# Altium project EDA-04211-V4-0_project.PrjPCB (part 3 of 3)

## Sheet Power.SchDoc: CPCI-Serial Backplane
size 420 x 297 mm; Date: 06/04/2023; CheckedBy: EG; GD; GK; MS; DrawnBy: M. Gąska; Address1: European Organization for Nuclear Research; Address2: CH-1211 Geneve 23 - Switzerland; DocumentNumber: 2; Revision: 2; SheetNumber: 2; SheetTotal: 5; Projet: DI/OT Crate; DivGrp: BE-CO; Title2: Power; Designer: G.Daniluk; ModifiedBy: M.Fafara; EDA_Number: EDA-04211-V4_0; CreateDate: 06/04/2023; CheckedDate: 06/04/2023
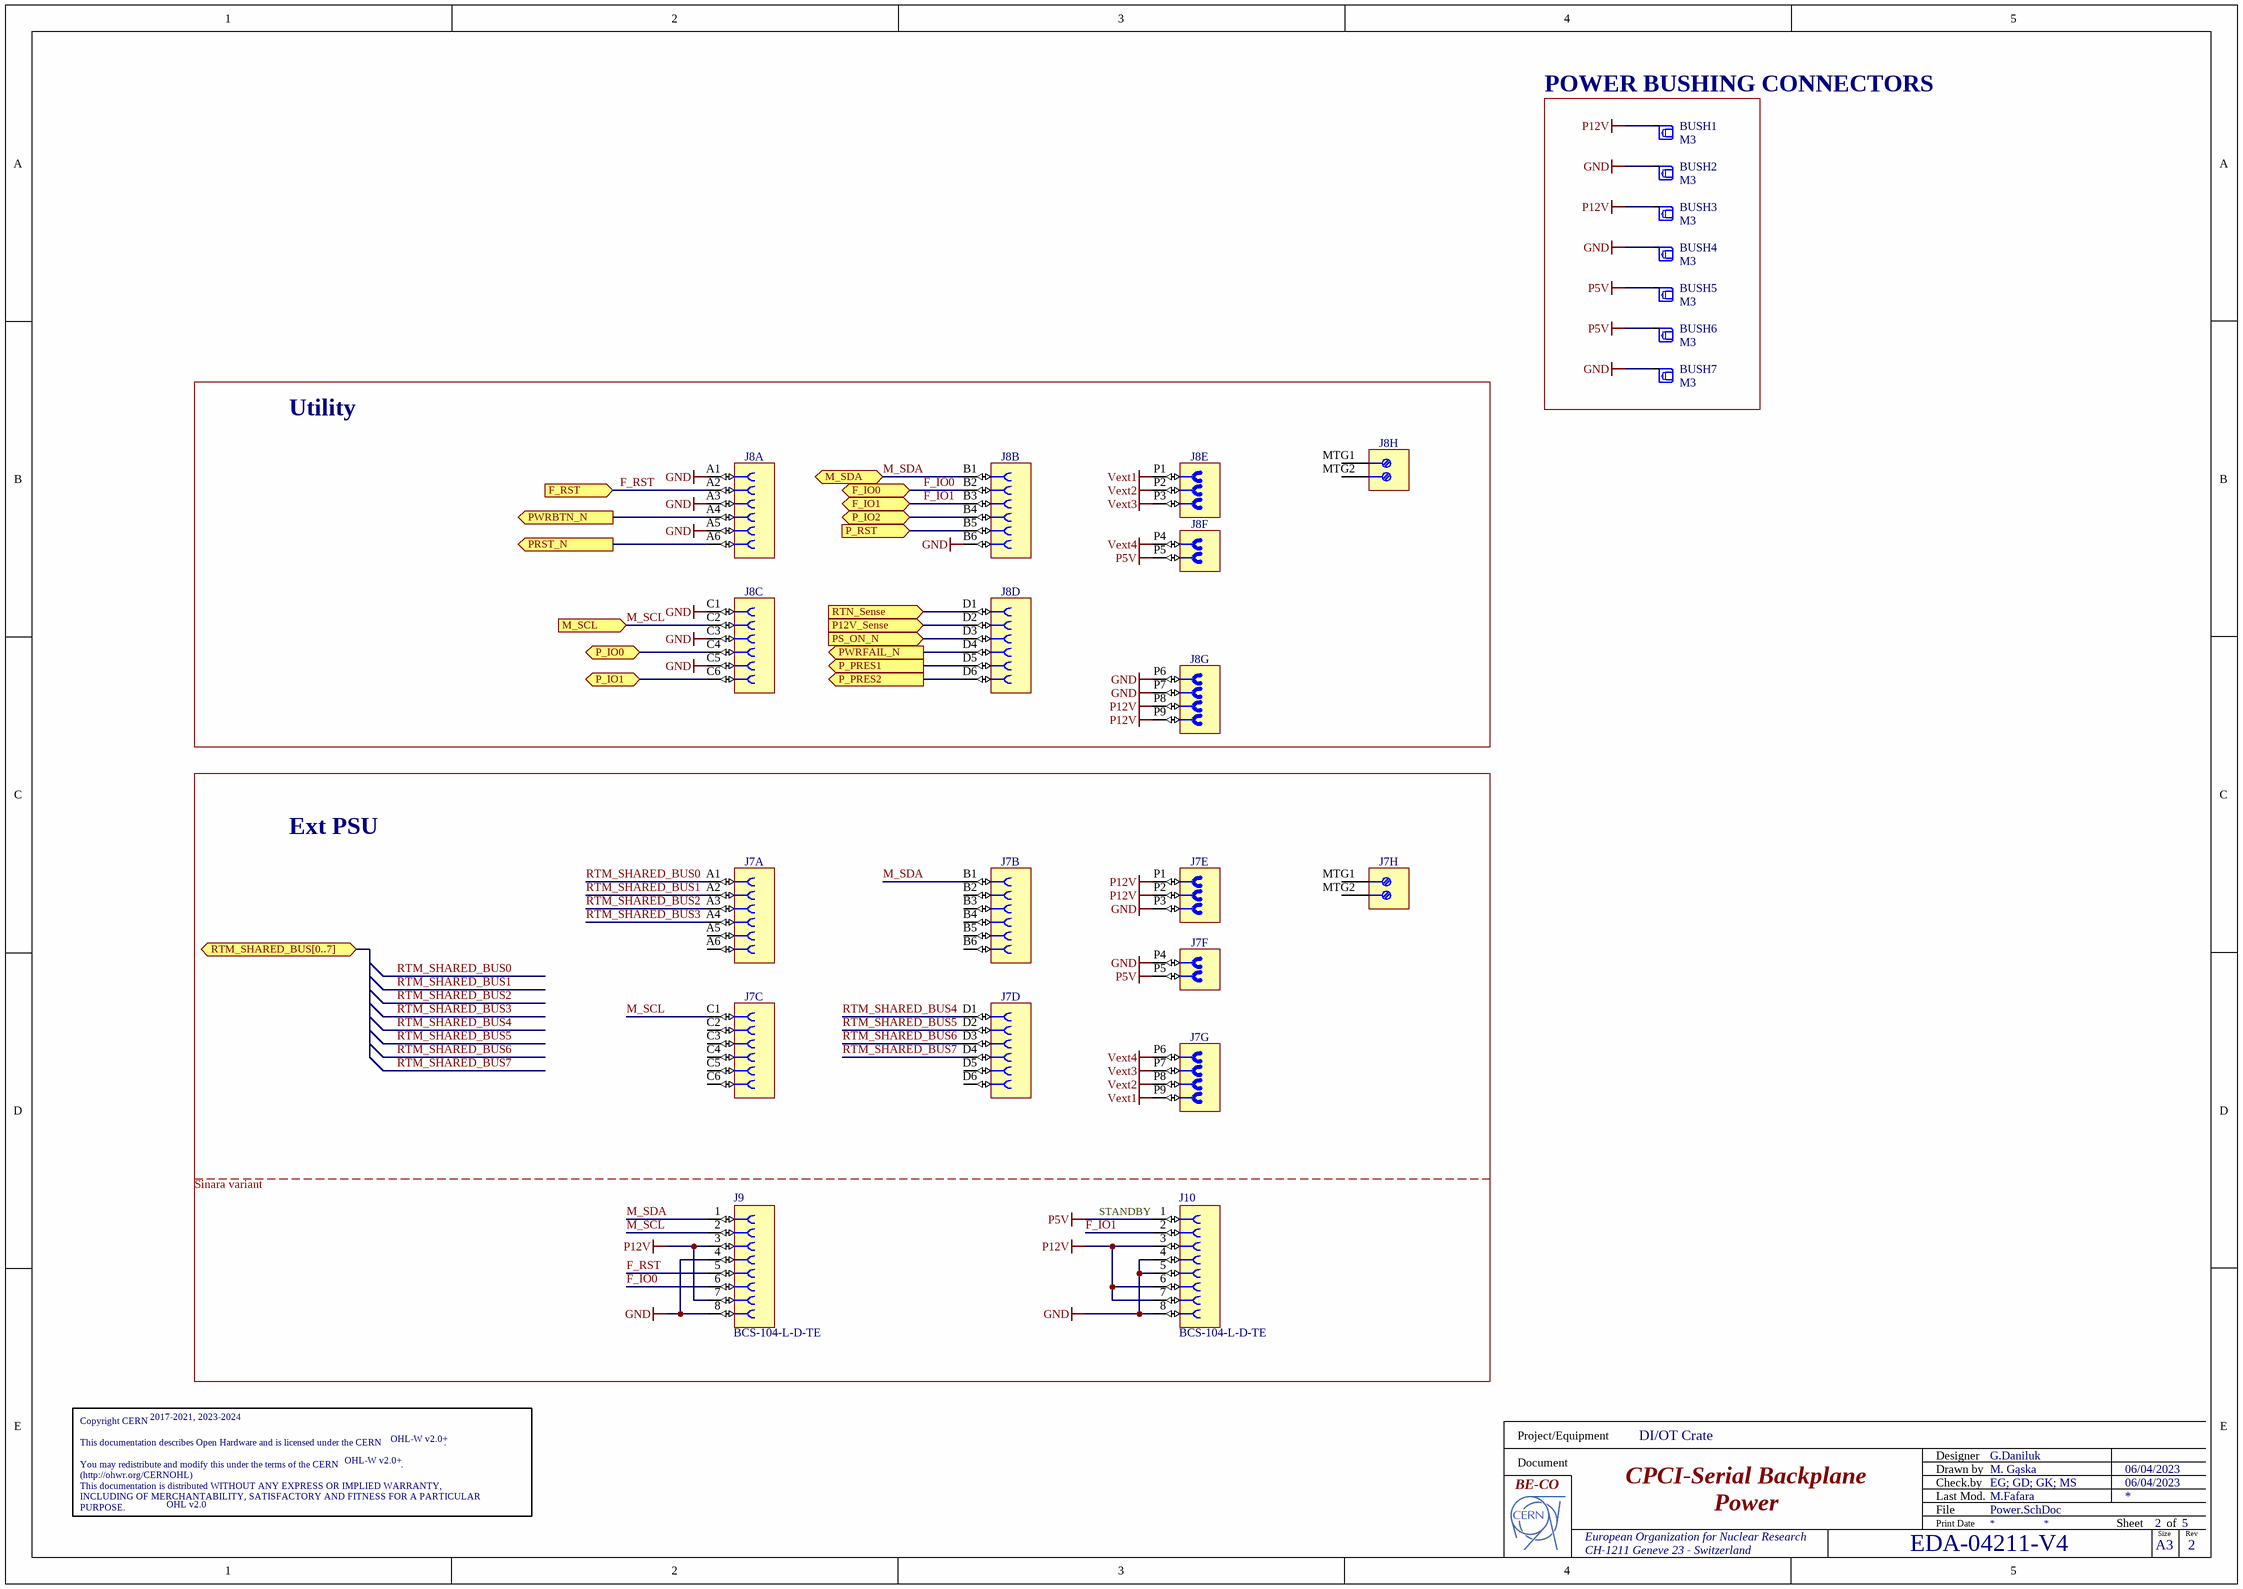
[diagram p2: Power.SchDoc]

### Parts
(Parts that share a designator on the sheet are numbered #1, #2 ... from top to bottom, then left to right.)
BUSH1  M3  [WURTH_7461057]
BUSH2  M3  [WURTH_7461057]
BUSH3  M3  [WURTH_7461057]
BUSH4  M3  [WURTH_7461057]
BUSH5  M3  [WURTH_7461057]
BUSH6  M3  [WURTH_7461057]
BUSH7  M3  [WURTH_7461057]
CERN_OHL#2  CERN_OHL  [CERN_OHL]  (value not drawn)  (graphical)
J7  PwrBlade  [AMPHENOL_51940-650]  (value not drawn)  (parts A,B,C,D,E,F,G,H of 8)
J8  PwrBlade  [AMPHENOL_51940-650]  (value not drawn)  (parts A,B,C,D,E,F,G,H of 8)
J9  BCS-104-L-D-TE  [SAMTEC_BCS-104-L-D-TE]
J10  BCS-104-L-D-TE  [SAMTEC_BCS-104-L-D-TE]

### Blocks framed on the sheet
POWER BUSHING CONNECTORS: BUSH1-BUSH7
Utility: J8
Ext PSU: J7 J9 J10

### Ports
F_IO0 (bidir), F_IO1 (bidir), F_RST (in), M_SCL (in), M_SDA (bidir), P12V_Sense (in), P_IO0 (bidir), P_IO1 (bidir), P_IO2 (bidir), P_PRES1 (out), P_PRES2 (out), P_RST (in), PRST_N (out), PS_ON_N (in), PWRBTN_N (out), PWRFAIL_N (out), RTM_SHARED_BUS[0..7] (bidir), RTN_Sense (in)

### Nets
GND: BUSH2.1 BUSH4.1 BUSH7.1 J7.P3 J7.P4 J8.A1 J8.A3 J8.A5 J8.B6 J8.C1 J8.C3 J8.C5 J8.P6 J8.P7 J9.4 J9.8 J10.4 J10.5 J10.8
P5V: BUSH5.1 BUSH6.1 J7.P5 J8.P5 J10.1
P12V: BUSH1.1 BUSH3.1 J7.P1 J7.P2 J8.P8 J8.P9 J9.3 J9.7 J10.3 J10.6 J10.7
Vext1: J7.P9 J8.P1
Vext2: J7.P8 J8.P2
Vext3: J7.P7 J8.P3
Vext4: J7.P6 J8.P4
F_IO0: J8.B2 J9.6 ; port F_IO0
F_IO1: J8.B3 J10.2 ; port F_IO1
F_RST: J8.A2 J9.5 ; port F_RST
M_SCL: J7.C1 J8.C2 J9.2 ; port M_SCL
M_SDA: J7.B1 J8.B1 J9.1 ; port M_SDA
P12V_Sense: J8.D2 ; port P12V_Sense
P_IO0: J8.C4 ; port P_IO0
P_IO1: J8.C6 ; port P_IO1
P_IO2: J8.B4 ; port P_IO2
P_PRES1: J8.D5 ; port P_PRES1
P_PRES2: J8.D6 ; port P_PRES2
P_RST: J8.B5 ; port P_RST
PRST_N: J8.A6 ; port PRST_N
PS_ON_N: J8.D3 ; port PS_ON_N
PWRBTN_N: J8.A4 ; port PWRBTN_N
PWRFAIL_N: J8.D4 ; port PWRFAIL_N
RTM_SHARED_BUS0: J7.A1
RTM_SHARED_BUS1: J7.A2
RTM_SHARED_BUS2: J7.A3
RTM_SHARED_BUS3: J7.A4
RTM_SHARED_BUS4: J7.D1
RTM_SHARED_BUS5: J7.D2
RTM_SHARED_BUS6: J7.D3
RTM_SHARED_BUS7: J7.D4
RTN_Sense: J8.D1 ; port RTN_Sense

Not connected (* = marked no-connect by the designer): J7 A5 A6 B2 B3 B4 B5 B6 C2 C3 C4 C5 C6 D5 D6 MTG1 MTG2; J8 MTG1 MTG2

### Notes on the sheet
- Sinara variant
- (near J10) STANDBY
- Project/Equipment
- Document
- Designer
- Drawn by
- Check.by
- File
- Last Mod.
- Print Date
- Sheet
- Size
- A3
- of
- Rev
- (in symbol CERN_OHL) Copyright CERN / This documentation describes Open Hardware and is licensed under the CERN                         . / You may redistribute and modify this under the terms of the CERN                         . / (http://ohwr.org/CERNOHL) / This documentation is distributed WITHOUT ANY EXPRESS OR IMPLIED WARRANTY, / INCLUDING OF MERCHANTABILITY, SATISFACTORY AND FITNESS FOR A PARTICULAR PURPOSE. / Please see the CERN                   for applicable conditions.

### Library data of the parts
BUSH1-BUSH7 = WURTH_7461057: Bush; Part Description: REDCUBE Bush with Threaded Hole M3 and Two Rows Press-Fit Pin-Plate, WP-BUTR Series; Manufacturer: WURTH; Part Number: WURTH_7461057; Component Kind: Standard; Component Type: Standard; Pin Count: 6; PackageDescription: 7x7x6mm REDCUBE Press-Fit with Internsl Threaded Hole M3,Two Rows Pin-Plate WP-BUTR; Mounted: Yes; Socket: No; SMD: No; PressFit: Yes; Sense: No; Status: None; Value: M3; Manufacturer Part Number: 7461057; ComponentHeight: 6mm; HelpURL: \\cern.ch\dfs\Applications\Altium\Datasheets\WURTH_7461057.pdf; Author: CERN DEM JLC; CreateDate: 13.08.2018; LatestRevisionDate: 13.08.2018
CERN_OHL#2 = CERN_OHL: as CERN_OHL#1 on sheet EDA-04211-V4; OHL_Date: 2017-2021, 2023-2024; Part Number: CERN_OHL; Component Type: Standard (No BOM); Pin Count: 0; Socket: No; SMD: No; Sense: No; Status: None; ComponentHeight: 0mm; HelpURL: Undefined; Author: CERN DEM HF; CreateDate: 03/12/2021; LatestRevisionDate: 03/12/2021; PackageDescription: Texte Copyright Cern
J7 J8 = AMPHENOL_51940-650: Thru-Hole, Lead 3.43mm, PowerBlade Vertical Power Connector 3ACP 2P 24S 4DCP Contacts; Part Description: Vertical PowerBlade Power Connector 3ACP + 2P + 24S + 4DCP PressFit Contacts; Part Number: AMPHENOL_51940-650; Component Kind: Standard; Component Type: Standard; Pin Count: 28; Family: PwrBlade; Mounted: Yes; Socket: No; SMD: No; PressFit: Yes; Sense: No; Status: None; Manufacturer: AMPHENOL; Manufacturer Part Number: 51940-650; ComponentHeight: 12.7mm; HelpURL: \\cern.ch\dfs\Applications\Altium\Datasheets\AMPHENOL_51940-650.pdf; Author: CERN DEM HF
  J7: CreateDate: 13.12.2022; LatestRevisionDate: 13.12.2022
  J8: CreateDate: 13/12/2022; LatestRevisionDate: 13/12/2022
J9 J10 = CMP-002-04655-3: Board Connector, 8 Contact(s), 2 Row(s), Female, Straight, 0.1 inch Pitch, Solder Terminal, Black Insulator, Plug; Max Operating Temperature: 125°C; Min Operating Temperature: -65°C; Mounting Technology: Board; RoHS Compliant: Yes; Connector Type: BOARD CONNECTOR

## Sheet Slot_1b.SchDoc: CPCI-Serial Backplane
size 420 x 297 mm; Date: 05/04/2023; CheckedBy: EG; GD; GK; MS; DrawnBy: M. Gąska; Address1: European Organization for Nuclear Research; Address2: CH-1211 Geneve 23 - Switzerland; DocumentNumber: 3; Revision: 2; SheetNumber: 3; SheetTotal: 5; Projet: DI/OT Crate; DivGrp: BE-CO; Title2: Slot 1b; Designer: G.Daniluk; ModifiedBy: J.Kuhn; EDA_Number: EDA-04211-V4_0; CreateDate: 05/04/2023; CheckedDate: 05/04/2023
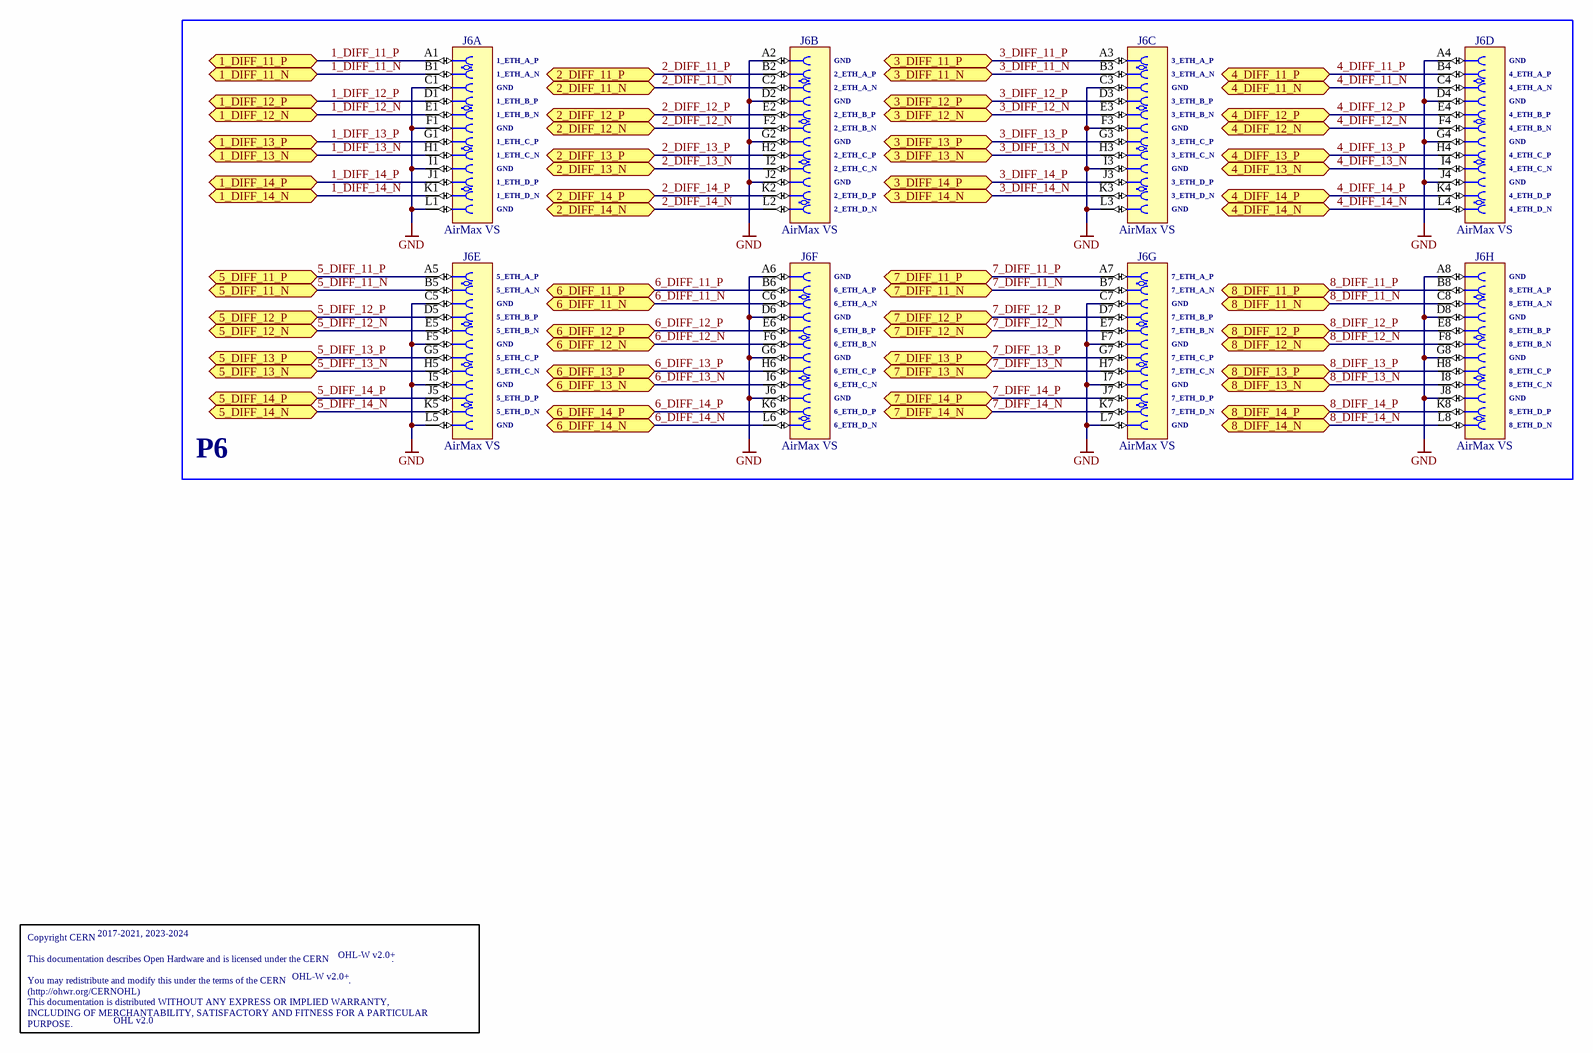
[diagram p3: Slot_1b.SchDoc]

### Parts
(Parts that share a designator on the sheet are numbered #1, #2 ... from top to bottom, then left to right.)
CERN_OHL#3  CERN_OHL  [CERN_OHL]  (value not drawn)  (graphical)
J6  AirMax VS  [AMPHENOL_10052842-101LF]  (parts A,B,C,D,E,F,G,H of 8)

### Blocks framed on the sheet
P6: J6

### Ports
1_DIFF_11_N (bidir), 1_DIFF_11_P (bidir), 1_DIFF_12_N (bidir), 1_DIFF_12_P (bidir), 1_DIFF_13_N (bidir), 1_DIFF_13_P (bidir), 1_DIFF_14_N (bidir), 1_DIFF_14_P (bidir), 2_DIFF_11_N (bidir), 2_DIFF_11_P (bidir), 2_DIFF_12_N (bidir), 2_DIFF_12_P (bidir), 2_DIFF_13_N (bidir), 2_DIFF_13_P (bidir), 2_DIFF_14_N (bidir), 2_DIFF_14_P (bidir), 3_DIFF_11_N (bidir), 3_DIFF_11_P (bidir), 3_DIFF_12_N (bidir), 3_DIFF_12_P (bidir), 3_DIFF_13_N (bidir), 3_DIFF_13_P (bidir), 3_DIFF_14_N (bidir), 3_DIFF_14_P (bidir), 4_DIFF_11_N (bidir), 4_DIFF_11_P (bidir), 4_DIFF_12_N (bidir), 4_DIFF_12_P (bidir), 4_DIFF_13_N (bidir), 4_DIFF_13_P (bidir), 4_DIFF_14_N (bidir), 4_DIFF_14_P (bidir), 5_DIFF_11_N (bidir), 5_DIFF_11_P (bidir), 5_DIFF_12_N (bidir), 5_DIFF_12_P (bidir), 5_DIFF_13_N (bidir), 5_DIFF_13_P (bidir), 5_DIFF_14_N (bidir), 5_DIFF_14_P (bidir), 6_DIFF_11_N (bidir), 6_DIFF_11_P (bidir), 6_DIFF_12_N (bidir), 6_DIFF_12_P (bidir), 6_DIFF_13_N (bidir), 6_DIFF_13_P (bidir), 6_DIFF_14_N (bidir), 6_DIFF_14_P (bidir), 7_DIFF_11_N (bidir), 7_DIFF_11_P (bidir), 7_DIFF_12_N (bidir), 7_DIFF_12_P (bidir), 7_DIFF_13_N (bidir), 7_DIFF_13_P (bidir), 7_DIFF_14_N (bidir), 7_DIFF_14_P (bidir), 8_DIFF_11_N (bidir), 8_DIFF_11_P (bidir), 8_DIFF_12_N (bidir), 8_DIFF_12_P (bidir), 8_DIFF_13_N (bidir), 8_DIFF_13_P (bidir), 8_DIFF_14_N (bidir), 8_DIFF_14_P (bidir)

### Nets
GND: J6.A2 J6.A4 J6.A6 J6.A8 J6.C1 J6.C3 J6.C5 J6.C7 J6.D2 J6.D4 J6.D6 J6.D8 J6.F1 J6.F3 J6.F5 J6.F7 J6.G2 J6.G4 J6.G6 J6.G8 J6.I1 J6.I3 J6.I5 J6.I7 J6.J2 J6.J4 J6.J6 J6.J8 J6.L1 J6.L3 J6.L5 J6.L7
1_DIFF_11_N: J6.B1 ; port 1_DIFF_11_N
1_DIFF_11_P: J6.A1 ; port 1_DIFF_11_P
1_DIFF_12_N: J6.E1 ; port 1_DIFF_12_N
1_DIFF_12_P: J6.D1 ; port 1_DIFF_12_P
1_DIFF_13_N: J6.H1 ; port 1_DIFF_13_N
1_DIFF_13_P: J6.G1 ; port 1_DIFF_13_P
1_DIFF_14_N: J6.K1 ; port 1_DIFF_14_N
1_DIFF_14_P: J6.J1 ; port 1_DIFF_14_P
2_DIFF_11_N: J6.C2 ; port 2_DIFF_11_N
2_DIFF_11_P: J6.B2 ; port 2_DIFF_11_P
2_DIFF_12_N: J6.F2 ; port 2_DIFF_12_N
2_DIFF_12_P: J6.E2 ; port 2_DIFF_12_P
2_DIFF_13_N: J6.I2 ; port 2_DIFF_13_N
2_DIFF_13_P: J6.H2 ; port 2_DIFF_13_P
2_DIFF_14_N: J6.L2 ; port 2_DIFF_14_N
2_DIFF_14_P: J6.K2 ; port 2_DIFF_14_P
3_DIFF_11_N: J6.B3 ; port 3_DIFF_11_N
3_DIFF_11_P: J6.A3 ; port 3_DIFF_11_P
3_DIFF_12_N: J6.E3 ; port 3_DIFF_12_N
3_DIFF_12_P: J6.D3 ; port 3_DIFF_12_P
3_DIFF_13_N: J6.H3 ; port 3_DIFF_13_N
3_DIFF_13_P: J6.G3 ; port 3_DIFF_13_P
3_DIFF_14_N: J6.K3 ; port 3_DIFF_14_N
3_DIFF_14_P: J6.J3 ; port 3_DIFF_14_P
4_DIFF_11_N: J6.C4 ; port 4_DIFF_11_N
4_DIFF_11_P: J6.B4 ; port 4_DIFF_11_P
4_DIFF_12_N: J6.F4 ; port 4_DIFF_12_N
4_DIFF_12_P: J6.E4 ; port 4_DIFF_12_P
4_DIFF_13_N: J6.I4 ; port 4_DIFF_13_N
4_DIFF_13_P: J6.H4 ; port 4_DIFF_13_P
4_DIFF_14_N: J6.L4 ; port 4_DIFF_14_N
4_DIFF_14_P: J6.K4 ; port 4_DIFF_14_P
5_DIFF_11_N: J6.B5 ; port 5_DIFF_11_N
5_DIFF_11_P: J6.A5 ; port 5_DIFF_11_P
5_DIFF_12_N: J6.E5 ; port 5_DIFF_12_N
5_DIFF_12_P: J6.D5 ; port 5_DIFF_12_P
5_DIFF_13_N: J6.H5 ; port 5_DIFF_13_N
5_DIFF_13_P: J6.G5 ; port 5_DIFF_13_P
5_DIFF_14_N: J6.K5 ; port 5_DIFF_14_N
5_DIFF_14_P: J6.J5 ; port 5_DIFF_14_P
6_DIFF_11_N: J6.C6 ; port 6_DIFF_11_N
6_DIFF_11_P: J6.B6 ; port 6_DIFF_11_P
6_DIFF_12_N: J6.F6 ; port 6_DIFF_12_N
6_DIFF_12_P: J6.E6 ; port 6_DIFF_12_P
6_DIFF_13_N: J6.I6 ; port 6_DIFF_13_N
6_DIFF_13_P: J6.H6 ; port 6_DIFF_13_P
6_DIFF_14_N: J6.L6 ; port 6_DIFF_14_N
6_DIFF_14_P: J6.K6 ; port 6_DIFF_14_P
7_DIFF_11_N: J6.B7 ; port 7_DIFF_11_N
7_DIFF_11_P: J6.A7 ; port 7_DIFF_11_P
7_DIFF_12_N: J6.E7 ; port 7_DIFF_12_N
7_DIFF_12_P: J6.D7 ; port 7_DIFF_12_P
7_DIFF_13_N: J6.H7 ; port 7_DIFF_13_N
7_DIFF_13_P: J6.G7 ; port 7_DIFF_13_P
7_DIFF_14_N: J6.K7 ; port 7_DIFF_14_N
7_DIFF_14_P: J6.J7 ; port 7_DIFF_14_P
8_DIFF_11_N: J6.C8 ; port 8_DIFF_11_N
8_DIFF_11_P: J6.B8 ; port 8_DIFF_11_P
8_DIFF_12_N: J6.F8 ; port 8_DIFF_12_N
8_DIFF_12_P: J6.E8 ; port 8_DIFF_12_P
8_DIFF_13_N: J6.I8 ; port 8_DIFF_13_N
8_DIFF_13_P: J6.H8 ; port 8_DIFF_13_P
8_DIFF_14_N: J6.L8 ; port 8_DIFF_14_N
8_DIFF_14_P: J6.K8 ; port 8_DIFF_14_P

### Notes on the sheet
- (near J6) 1_ETH_A_P
- (near J6) 1_ETH_A_N
- (near J6) 1_ETH_B_P
- (near J6) 1_ETH_B_N
- (near J6) GND
- (near J6) 2_ETH_B_P
- (near J6) 2_ETH_A_N
- (near J6) 2_ETH_A_P
- (near J6) 3_ETH_B_P
- (near J6) 3_ETH_B_N
- (near J6) 3_ETH_A_N
- (near J6) 3_ETH_A_P
- (near J6) 4_ETH_B_P
- (near J6) 4_ETH_A_N
- (near J6) 4_ETH_A_P
- (near J6) 1_ETH_C_P
- (near J6) 1_ETH_C_N
- (near J6) 1_ETH_D_P
- (near J6) 2_ETH_C_N
- (near J6) 2_ETH_C_P
- (near J6) 2_ETH_B_N
- (near J6) 3_ETH_D_P
- (near J6) 3_ETH_C_P
- (near J6) 3_ETH_C_N
- (near J6) 4_ETH_C_N
- (near J6) 4_ETH_C_P
- (near J6) 4_ETH_B_N
- (near J6) 1_ETH_D_N
- (near J6) 2_ETH_D_N
- (near J6) 2_ETH_D_P
- (near J6) 3_ETH_D_N
- (near J6) 4_ETH_D_N
- (near J6) 4_ETH_D_P
- (near J6) 5_ETH_B_P
- (near J6) 5_ETH_A_N
- (near J6) 5_ETH_A_P
- (near J6) 6_ETH_A_N
- (near J6) 6_ETH_A_P
- (near J6) 7_ETH_B_P
- (near J6) 7_ETH_A_N
- (near J6) 7_ETH_A_P
- (near J6) 8_ETH_A_P
- (near J6) 8_ETH_A_N
- (near J6) 5_ETH_C_N
- (near J6) 5_ETH_C_P
- (near J6) 5_ETH_B_N
- (near J6) 6_ETH_C_N
- (near J6) 6_ETH_C_P
- (near J6) 6_ETH_B_N
- (near J6) 6_ETH_B_P
- (near J6) 7_ETH_C_N
- (near J6) 7_ETH_C_P
- (near J6) 7_ETH_B_N
- (near J6) 8_ETH_B_P
- (near J6) 8_ETH_B_N
- (near J6) 8_ETH_C_P
- (near J6) 8_ETH_C_N
- (near J6) 5_ETH_D_N
- (near J6) 5_ETH_D_P
- (near J6) 6_ETH_D_N
- (near J6) 6_ETH_D_P
- (near J6) 7_ETH_D_N
- (near J6) 7_ETH_D_P
- (near J6) 8_ETH_D_P
- (near J6) 8_ETH_D_N
- Project/Equipment
- Document
- Designer
- Drawn by
- Check.by
- File
- Last Mod.
- Print Date
- Sheet
- Size
- A3
- of
- Rev
- (in symbol CERN_OHL) Copyright CERN / This documentation describes Open Hardware and is licensed under the CERN                         . / You may redistribute and modify this under the terms of the CERN                         . / (http://ohwr.org/CERNOHL) / This documentation is distributed WITHOUT ANY EXPRESS OR IMPLIED WARRANTY, / INCLUDING OF MERCHANTABILITY, SATISFACTORY AND FITNESS FOR A PARTICULAR PURPOSE. / Please see the CERN                   for applicable conditions.

### Library data of the parts
CERN_OHL#3 = CERN_OHL: Part Description: Copyright CERN; OHL_License: OHL-W v2.0+; OHL_Version: OHL v2.0; Mounted: No; OHL_Date: 2017-2021, 2023-2024; Part Number: CERN_OHL; Component Type: Standard (No BOM); Pin Count: 0; Socket: No; SMD: No; Sense: No; Status: None; ComponentHeight: 0mm; HelpURL: Undefined; Author: CERN DEM HF; CreateDate: 03/12/2021; LatestRevisionDate: 03/12/2021; PackageDescription: Texte Copyright Cern
J6 = AMPHENOL_10052842-101LF: 96 Contacts Receptacle, 8 Columns, 4 Pairs per Column; Part Description: 96 Contacts, 2mm Pitch, 8 Columns, 4 Pairs per Column, Vertical Receptacle; Part Number: AMPHENOL_10052842-101LF; Component Kind: Standard; Component Type: Standard; Pin Count: 96; Family: AirMax VS; Mounted: Yes; Socket: No; SMD: No; PressFit: Yes; Sense: No; Status: None; Manufacturer: AMPHENOL; Manufacturer Part Number: 10052842-101LF; ComponentHeight: 10.85mm; HelpURL: \\cern.ch\dfs\Applications\Altium\Datasheets\AMPHENOL_10052842-101LF.pdf; ComponentLink1URL: \\cern.ch\dfs\Applications\Altium\Datasheets\AMPHENOL_10052842-101LF_Application.pdf; ComponentLink1Description: Application; Author: CERN DEM MR; CreateDate: 30.04.2019; LatestRevisionDate: 30.04.2019

## Nets that join several sheets
GND: EDA-04211-V4 (36 pins), Power (19 pins), Slot_1b (32 pins)

## Assembly variants
Sinara: not fitted BUSH1 BUSH2 BUSH3 BUSH4 BUSH5 BUSH6 BUSH7 GUIDE1 GUIDE2 GUIDE3 GUIDE4 GUIDE5 GUIDE6 GUIDE7 GUIDE8 J7 J13_Slot1 J13_Slot2 J13_Slot3 J13_Slot4 J13_Slot5 J13_Slot6 J13_Slot7 J13_Slot8 J14_Slot1 J14_Slot2 J14_Slot3 J14_Slot4 J14_Slot5 J14_Slot6 J14_Slot7 J14_Slot8 J23_Slot1 J23_Slot2 J23_Slot3 J23_Slot4 J23_Slot5 J23_Slot6 J23_Slot7 J23_Slot8 J24_Slot1 J24_Slot2 J24_Slot3 J24_Slot4 J24_Slot5 J24_Slot6 J24_Slot7 J24_Slot8
DIOT: not fitted BUSH1 BUSH2 BUSH3 BUSH4 BUSH5 BUSH6 BUSH7 J9 J10